# EAGLE design Clock (EAGLE 8.2.2)
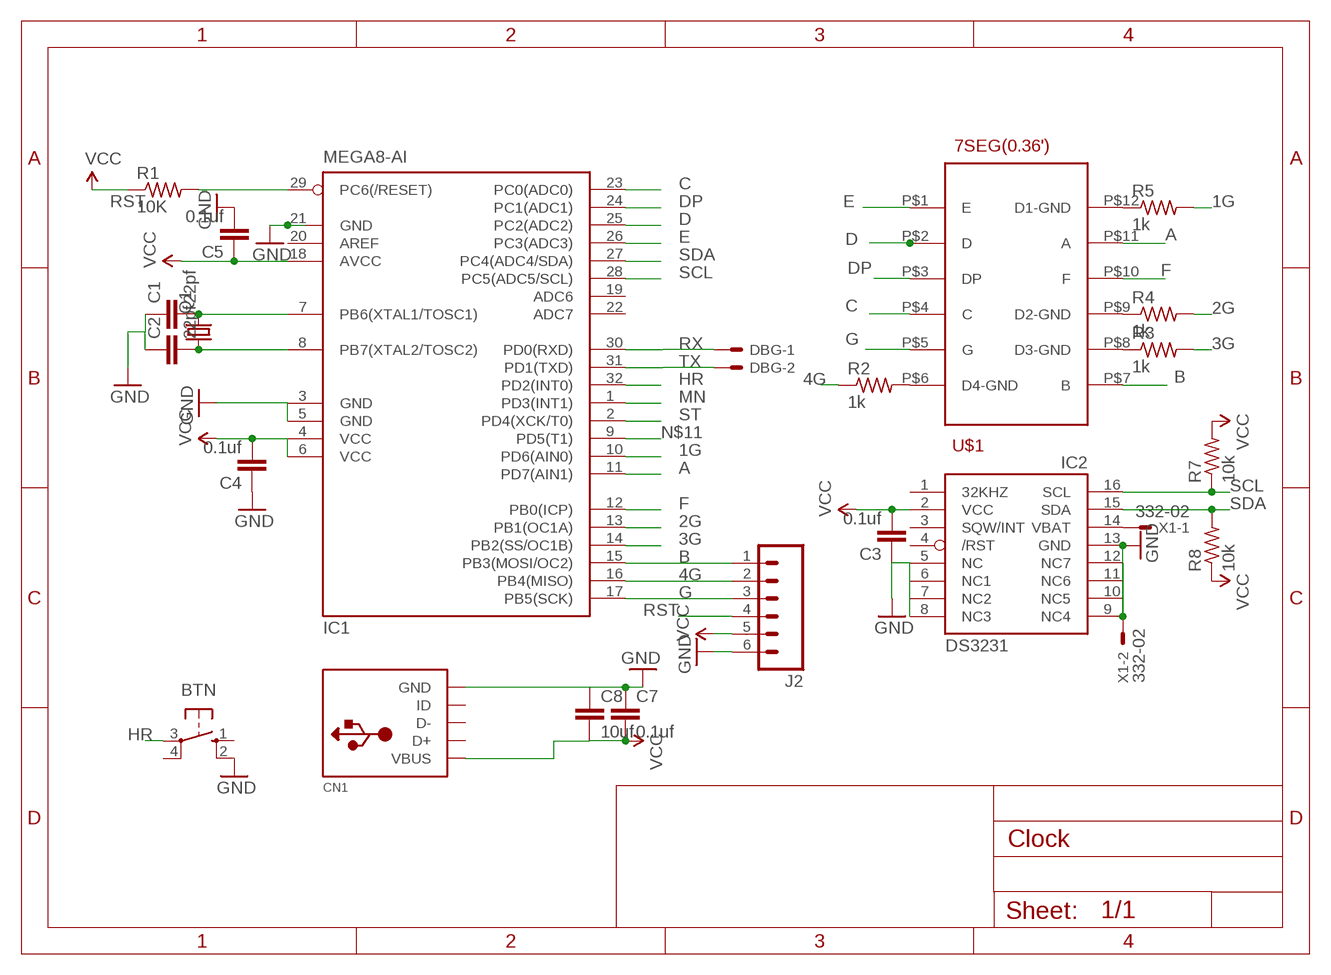
[diagram p0: schematic, sheet 1]

## Parts
BTN  10-XX  [B3F-10XX]
C1  22pf  C-EUC0603  [C0603]
C2  22pf  C-EUC0603  [C0603]
C3  0.1uf  C-EUC0603  [C0603]
C4  0.1uf  C-EUC0603  [C0603]
C5  0.1uf  C-EUC0603  [C0603]
C7  0.1uf  C-EUC0603  [C0603]
C8  10uf  C-EUC0603  [C0603]
CN1  USBMINIB  [USB-MINIB]
DBG  332-02  [332-02]
IC1  MEGA8-AI  [TQFP32-08]
IC2  DS3231/SO  [SO16W]
J2  M06LOCK_LONGPADS  [1X06_LOCK_LONGPADS]
Q1  CRYSTALHC49S  [HC49/S]
R1  10K  R-US_R0603  [R0603]
R2  1k  R-US_R0603  [R0603]
R3  1k  R-US_R0603  [R0603]
R4  1k  R-US_R0603  [R0603]
R5  1k  R-US_R0603  [R0603]
R7  10k  R-US_R0603  [R0603]
R8  10k  R-US_R0603  [R0603]
U$1  7SEG7SEG12  [DIP127SEG.36']
X1  332-02  [332-02]

## Nets
1G: IC1.10(PD6(AIN0)) R5.2
2G: IC1.13(PB1(OC1A)) R4.2
3G: IC1.14(PB2(SS/OC1B)) R3.2
4G: IC1.16(PB4(MISO)) J2.2 R2.1
A: IC1.11(PD7(AIN1)) U$1.P$11(A)
B: IC1.15(PB3(MOSI/OC2)) J2.1 U$1.P$7(B)
C: IC1.23(PC0(ADC0)) U$1.P$4(C)
D: IC1.25(PC2(ADC2)) U$1.P$2(D)
DP: IC1.24(PC1(ADC1)) U$1.P$3(DP)
E: IC1.26(PC3(ADC3)) U$1.P$1(E)
F: IC1.12(PB0(ICP)) U$1.P$10(F)
G: IC1.17(PB5(SCK)) J2.3 U$1.P$5(G)
GND: BTN.2(S1) C1.1 C2.1 C3.1 C4.1 C5.2 C7.1 C8.1 CN1.GND IC1.3(GND) IC1.5(GND) IC1.21(GND) IC2.5(NC) IC2.6(NC1) IC2.7(NC2) IC2.8(NC3) IC2.9(NC4) IC2.10(NC5) IC2.11(NC6) IC2.12(NC7) IC2.13(GND) J2.6 X1.2
HR: BTN.3(P) IC1.32(PD2(INT0))
MN: IC1.1(PD3(INT1))
N$1: IC2.14(VBAT) X1.1
N$2: R3.1 U$1.P$8(D3-GND)
N$3: R4.1 U$1.P$9(D2-GND)
N$4: R5.1 U$1.P$12(D1-GND)
N$8: C1.2 IC1.7(PB6(XTAL1/TOSC1)) Q1.2
N$11: IC1.9(PD5(T1))
N$14: R2.2 U$1.P$6(D4-GND)
N$24: C2.2 IC1.8(PB7(XTAL2/TOSC2)) Q1.1
RST: IC1.29(PC6(/RESET)) J2.4 R1.2
RX: DBG.1 IC1.30(PD0(RXD))
SCL: IC1.28(PC5(ADC5/SCL)) IC2.16(SCL) R7.1
SDA: IC1.27(PC4(ADC4/SDA)) IC2.15(SDA) R8.2
ST: IC1.2(PD4(XCK/T0))
TX: DBG.2 IC1.31(PD1(TXD))
VCC: C3.2 C4.2 C5.1 C7.2 C8.2 CN1.VBUS IC1.4(VCC) IC1.6(VCC) IC1.18(AVCC) IC2.2(VCC) J2.5 R1.1 R7.2 R8.1
Unconnected: BTN.1(S) BTN.4(P1) CN1.D+ CN1.D- CN1.ID IC1.19(ADC6) IC1.20(AREF) IC1.22(ADC7) IC2.1(32KHZ) IC2.3(SQW/INT) IC2.4(/RST)

## Library data of the parts
BTN = switch-omron:10-XX: OMRON SWITCH; MPN: B3F-1000; OC_FARNELL: 176432; OC_NEWARK: 36M3542
C1-C5 C7 C8 = rcl:C-EU: CAPACITOR, European symbol
CN1 = adafruit:USB: USB Connectors USBMINIB - Surface Mount Female Mini-B USB Connector 4UConnector: 06564 By microbuilder.eu Thru-hole RA Female Mini-B USB Connector 4UConnector: 18732 By ladyada.net
DBG X1 = con-garry:332-02: 2 Pin - 2mm Dual Row Source: www.mpe-connector.de / garry_shortform_2012.pdf
IC1 = atmel:MEGA8: MICROCONTROLLER 8 Kbytes FLASH, 1 kbytes SRAM, 512 bytes EEPROM, USART, 6-channel 10 bit ADC, 2-channel 8 bit ADC Pin compatible with Atmega48, ATMega88, ATMega168 Source: avr.lbr; MPN: ATMEGA8-16AU; OC_FARNELL: 9171371; OC_NEWARK: 73M8863
IC2 = adafruit:DS3231
J2 = SparkFun-Connectors:M06: Header 6 Standard 6-pin 0.1" header. Use with straight break away headers (SKU : PRT-00116), right angle break away headers (PRT-00553), swiss pins (PRT-00743), machine pins (PRT-00117), and female headers (PRT-00115). Molex polarized connector foot print use with SKU : PRT-08094 with associated crimp pins and housings. NOTES ON THE VARIANTS LOCK and LOCK_LONGPADS... This footprint was designed to help hold the alignment of a through-hole component (i.e. 6-pin header) while soldering it into place. You may notice that each hole has been shifted either up or down by 0.005 of an inch from it's more standard position (which is a perfectly straight line). This slight alteration caused the pins (the squares in the middle) to touch the edges of the holes. Because they are alternating, it causes a "brace" to hold the component in place. 0.005 has proven to be the perfect amount of "off-center" position when using our standard breakaway headers. Although looks a little odd when you look at the bare footprint, once you have a header in there, the alteration is very hard to notice. Also,if you push a header all the way into place, it is covered up entirely on the bottom side. This idea of altering the position of holes to aid alignment will be further integrated into the Sparkfun Library for other footprints. It can help hold any component with 3 or more connection pins.
Q1 = adafruit:CRYSTAL: CRYSTAL; OC_FARNELL: 1667008; OC_NEWARK: unknown
R1-R5 R7 R8 = adafruit:R-US_: RESISTOR, American symbol
U$1 = ram_86:7SEG

## Board
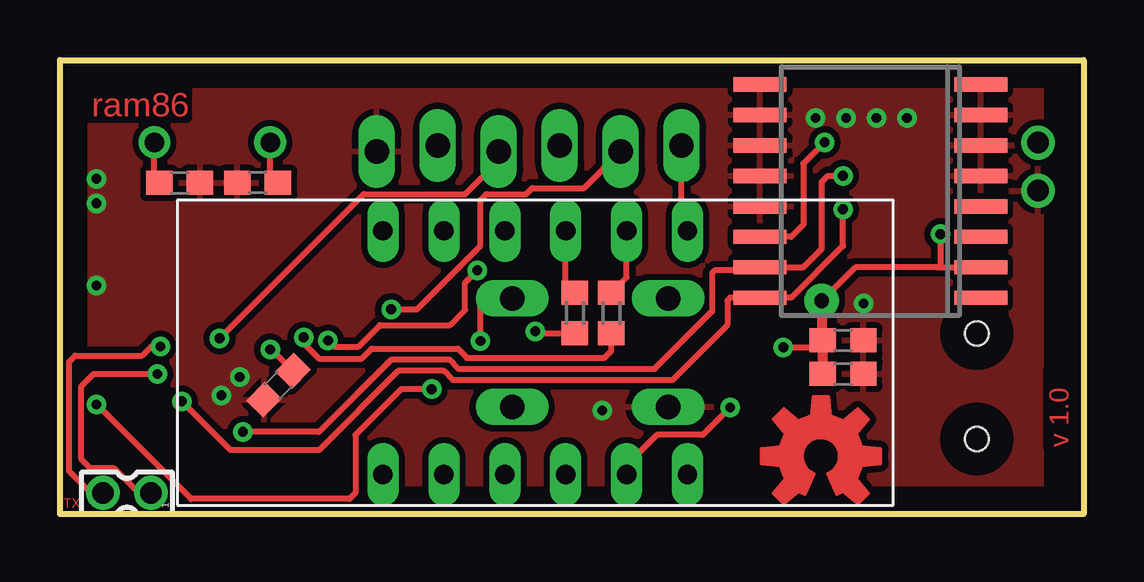
[diagram p1: board, top side]
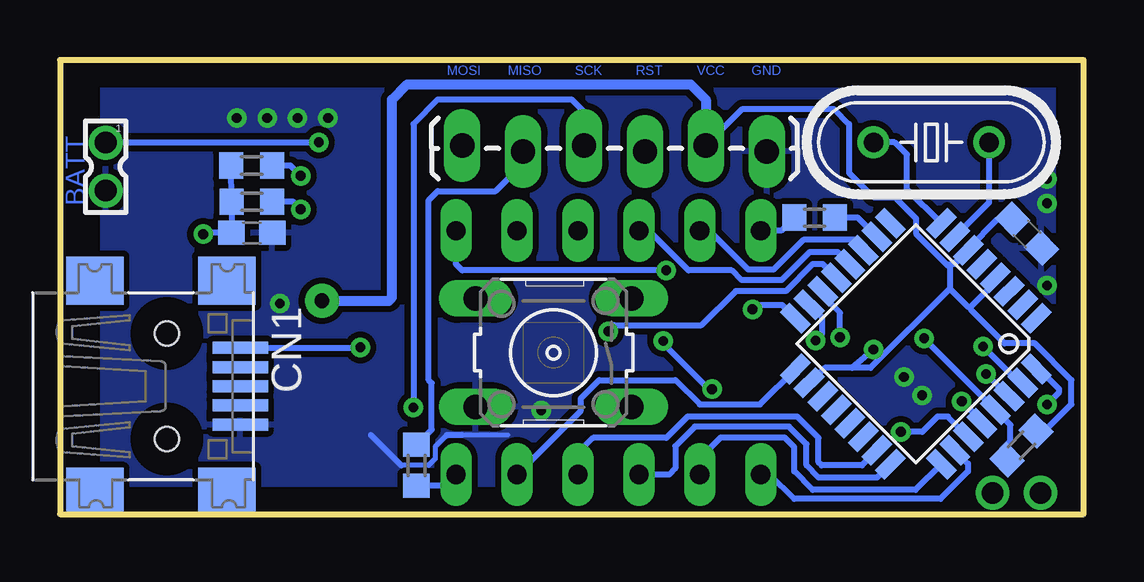
[diagram p2: board, bottom side, seen from below]

Size 42.67 x 18.92 mm. Coordinates in mm from the lower left corner, seen from the top.
Outline: 0,18.92 42.67,18.92 42.67,0 0,0 0,18.92
Copper layers (1*16): Top 0.035mm / dielectric 1.5mm / Bottom 0.035mm
Design rules "default *": minimum track width 10mil, minimum drill 24mil, track to track 10mil, track to pad 10mil, pad to pad 10mil, via to via 10mil, smd to smd 10mil, copper to edge 40mil, drill to drill 8mil, minimum pad ring 10mil, minimum via ring 8mil, stop-mask expansion 4mil, vias tented up to drill 24mil, thermal gap 10mil

### Footprints (pad centres in the part's own frame; a part is rotated, then mirrored left to right if it is on the bottom)
B3F-10XX = drill 1.016 long: 1 -3.251,2.261; 2 3.251,2.261; 3 -3.251,-2.261; 4 3.251,-2.261
C0603 = smd 1.1 x 1: 1 -0.85,0; 2 0.85,0
USB-MINIB = smd 0.5 x 2.308: D+ 0,4.064; D- -0.8,4.064; GND 1.6,4.064; ID 0.8,4.064; VBUS -1.6,4.064 | smd 2 x 2.4: GND1 -4.4,-2; GND2 -4.4,3.5; GND3 4.4,3.5; GND4 4.4,-2 | hole 1: -2.2,1; 2.2,1
332-02 = drill 0.9 pad 1.27: 1 0,-1; 2 0,1
TQFP32-08 = smd 1.27 x 0.559: 1 -4.293,2.8; 2 -4.293,2; 3 -4.293,1.2; 4 -4.293,0.4; 5 -4.293,-0.4; 6 -4.293,-1.2; 7 -4.293,-2; 8 -4.293,-2.8; 17 4.293,-2.8; 18 4.293,-2; 19 4.293,-1.2; 20 4.293,-0.4; 21 4.293,0.4; 22 4.293,1.2; 23 4.293,2; 24 4.293,2.8 | smd 0.559 x 1.27: 9 -2.8,-4.293; 10 -2,-4.293; 11 -1.2,-4.293; 12 -0.4,-4.293; 13 0.4,-4.293; 14 1.2,-4.293; 15 2,-4.293; 16 2.8,-4.293; 25 2.8,4.293; 26 2,4.293; 27 1.2,4.293; 28 0.4,4.293; 29 -0.4,4.293; 30 -1.2,4.293; 31 -2,4.293; 32 -2.8,4.293
SO16W = smd 0.6 x 2.2: 1 -4.445,-4.6; 2 -3.175,-4.6; 3 -1.905,-4.6; 4 -0.635,-4.6; 5 0.635,-4.6; 6 1.905,-4.6; 7 3.175,-4.6; 8 4.445,-4.6; 9 4.445,4.6; 10 3.175,4.6; 11 1.905,4.6; 12 0.635,4.6; 13 -0.635,4.6; 14 -1.905,4.6; 15 -3.175,4.6; 16 -4.445,4.6
1X06_LOCK_LONGPADS = drill 1.016 long: 1 0,0; 2 2.54,-0.254; 3 5.08,0; 4 7.62,-0.254; 5 10.16,0; 6 12.7,-0.254
HC49/S = drill 0.813: 1 -2.413,0; 2 2.413,0
R0603 = smd 1 x 1.1: 1 -0.85,0; 2 0.85,0
DIP127SEG.36' = drill 0.8 long: P$1 0,0; P$2 0,-2.54; P$3 0,-5.08; P$4 0,-7.62; P$5 0,-10.16; P$6 0,-12.7; P$7 10.16,-12.7; P$8 10.16,-10.16; P$9 10.16,-7.62; P$10 10.16,-5.08; P$11 10.16,-2.54; P$12 10.16,0

### Placement (x,y rotation side)
BTN  22.1,6.73 180 bottom
C1  4.99,13.81 180 top
C2  8.24,13.81 0 top
C3  34.67,11.72 180 bottom
C4  2.36,11.68 135 bottom
C5  9.11,5.37 225 top
C7  32.64,5.84 180 top
C8  32.64,7.24 180 top
CN1  39.22,5.33 270 bottom
DBG  2.79,0.89 90 top
IC1  6.99,7.1 225 bottom
IC2  33.78,13.46 90 top
J2  25.91,15.37 0 bottom
LOGO2  OSHW-LOGOM-COPPER  [OSHW-LOGO-M_COPPER]  31.72,2.41 0 top
Q1  6.35,15.49 0 bottom
R1  2.59,2.87 225 bottom
R2  27.81,2.03 270 bottom
R3  22.99,8.38 270 top
R4  21.46,8.38 270 top
R5  11.21,12.36 0 bottom
R7  34.67,13.02 180 bottom
R8  34.69,14.53 0 bottom
U$1  13.46,1.65 90 top
X1  40.77,14.48 180 bottom

### Tracks (layer width: path | path; a pad name or v marks a point on that pad's centre or on a via)
1G
  Bottom 0.254: IC1.10 9.42,12.36 R5.2
2G  (via drill 0.41)
  Top 0.254: v19.81,7.62 19.9,7.53 R4.2
  Bottom 0.254: IC1.13 10.87,10.41 11.3,10.41 12.42,9.3 14.5,9.3 15.93,7.87 19.56,7.87 v19.81,7.62
3G  (via drill 0.41)
  Top 0.254: 22.73,7.41 R3.2 22.99,6.81 22.69,6.52 16.97,6.52 16.59,6.9 12.99,6.9 12.57,6.48 10.79,6.48 10.16,7.11 v10.16,7.37
  Bottom 0.254: IC1.14 10.9,9.27 11.05,9.27 10.16,8.38 v10.16,7.37
4G  (via drill 0.41)
  Top 0.254: J2.2 21.84,13.59 19.68,13.59 19.43,13.34 17.78,13.34 17.53,13.08 17.53,11.18 16.55,10.2 | 16.55,10.2 16.51,10.16 | v13.8,8.53 14.88,8.53 16.55,10.2
  Bottom 0.254: R2.1 27.18,3.52 27.18,5.46 27.3,5.59 27.3,13.08 26.92,13.46 24.51,13.46 23.37,14.61 J2.2 | v13.8,8.53 13.61,8.73 12.58,8.73 IC1.16
A
  Bottom 0.254: IC1.11 9.18,11.09 9.52,11.43 11.68,11.43 12.93,10.19 13.98,10.19 15.61,11.81 U$1.P$11 15.62,11.81
B  (via drill 0.41)
  Top 0.254: v17.4,10.16 16.89,9.65 16.89,8.51 16.26,7.87 13.33,7.87 12.45,6.99 11.43,6.99 v11.18,7.24 | U$1.P$7 25.91,12.07 J2.1
  Bottom 0.254: IC1.15 10.92,8.2 10.92,7.49 v11.18,7.24 | v17.4,10.16 25.91,10.16 26.16,10.41 U$1.P$7
C
  Bottom 0.254: IC1.23 9.24,2.03 10.92,2.03 11.05,2.16 11.05,3.18 11.94,4.06 16.51,4.06 17.4,3.18 20.45,3.18 21.08,2.54 U$1.P$4
D
  Bottom 0.254: IC1.25 7.01,1.02 11.3,1.02 12.06,1.78 12.06,2.79 12.46,3.19 15.14,3.19 16,2.32 U$1.P$2 16.01,1.66 16.01,1.7 16,1.71 15.99,1.71 16,1.7 16,1.56
DP
  Bottom 0.254: IC1.24 8.61,1.52 11.05,1.52 11.56,2.03 11.56,2.92 12.28,3.65 16.21,3.65 17.02,2.83 17.02,1.91 17.27,1.65 U$1.P$3
E
  Bottom 0.254: IC1.26 4.83,2.11 4.83,1.78 5.97,0.64 12.06,0.64 13.08,1.65 U$1.P$1
F
  Bottom 0.254: IC1.12 10.25,10.92 11.43,10.92 12.6,9.75 14.26,9.75 14.67,10.16 16.47,10.16 18.12,11.81 U$1.P$10
G  (via drill 0.41)
  Top 0.254: v27.94,4.45 26.8,3.3 24.89,3.3 23.62,2.03 U$1.P$5
  Bottom 0.254: U$1.P$5 20.95,4.32 20.95,4.83 20.19,5.59 17.02,5.59 16,4.57 13.48,4.57 IC1.17 | J2.3 20.83,16.76 21.34,17.27 26.92,17.27 27.94,16.26 v27.94,4.45
GND  (via drill 0.41)
  Bottom 0.203: 26.54,3.3 27.03,2.81 27.03,2.3 27.3,2.03 28.45,2.03 | BTN.2 25.37,4.45 25.4,4.45 | 25.91,3.3 24,3.3
  Bottom 0.254: 29.72,3.3 28.45,2.03 | 26.54,3.3 25.91,3.3
  other vias: 22.61,4.32 6.73,4.95 7.49,5.71 1.52,13.97 1.52,12.95 1.52,9.52 31.5,16.51 32.77,16.51 34.04,16.51 35.31,16.51 33.5,8.78
  pour Bottom: 0.13,18.92 40.89,18.92 40.89,-0.25 0.13,-0.25
  pour Top: 0,18.92 40.89,18.92 40.89,-0.25 0,-0.25
HR  (via drill 0.41)
  Top 0.254: BTN.3 18.82,9.02 17.78,9.02 17.53,8.76 v17.53,7.21 17.53,7.18 | v15.49,5.21 14.22,5.21 12.32,3.3 12.32,0.89 12.06,0.64 5.46,0.64 v1.52,4.57
  Bottom 0.254: v15.49,5.21 15.62,5.21 17.5,7.09 v17.53,7.21 | v1.52,4.57 1.02,5.08 1.02,5.21 1.86,6.05 IC1.32
N$1  (via drill 0.41)
  Top 0.254: v31.88,15.49 30.99,14.61 30.99,12.07 30.48,11.56 IC2.14
  Bottom 0.254: X1.1 41,15.49 v31.88,15.49
N$2
  Top 0.254: R3.1 23.62,9.87 U$1.P$8
N$3
  Top 0.254: R4.1 21.08,9.61 U$1.P$9
N$4
  Bottom 0.254: R5.1 12.61,11.81 U$1.P$12
N$8
  Top 0.254: C1.2 3.94,14.01 Q1.2
  Bottom 0.254: IC1.7 3.94,12.99 Q1.2
N$14
  Bottom 0.254: U$1.P$6 26.63,1.18 R2.2
N$24
  Top 0.254: C2.2 8.76,14.13 Q1.1
  Bottom 0.254: IC1.8 7.37,13.55 7.37,14.99 7.87,15.49 Q1.1
RST  (via drill 0.41)
  Top 0.254: v6.65,7.33 12.66,13.34 16.89,13.34 18.29,14.73 J2.4
  Bottom 0.254: 3.68,4.18 IC1.29 | IC1.29 v6.65,7.33 | IC1.29 3.05,3.72 3.05,3.05 3.43,2.67 3.43,2.5 R1.2
RX  (via drill 0.41)
  Top 0.254: DBG.1 3.29,0.89 2.27,1.91 1.27,1.91 0.89,2.29 0.89,5.33 1.4,5.84 v4.06,5.84
  Bottom 0.254: v4.06,5.84 3.14,4.92 IC1.30
SCL  (via drill 0.41)
  Top 0.254: v5.08,4.7 7.11,2.67 10.79,2.67 14.1,5.97 16,5.97 16.38,5.59 25.53,5.59 27.81,7.87 27.81,8.89 27.94,9.02 IC2.16 30.48,9.02 32.64,11.18 v32.64,12.7
  Bottom 0.254: v5.08,4.7 4.24,3.86 IC1.28 | v32.64,12.7 32.96,13.02 R7.1
SDA  (via drill 0.41)
  Top 0.254: v7.62,3.43 10.79,3.43 13.82,6.45 16.23,6.45 16.62,6.06 24.79,6.06 27.18,8.45 27.18,10.03 27.3,10.16 29.05,10.16 IC2.15 30.99,10.29 31.75,11.05 31.75,13.84 32,14.1 v32.64,14.1
  Bottom 0.254: 7.24,3.43 v7.62,3.43 6.73,3.43 6.1,4.06 5.65,4.06 IC1.27 | v32.64,14.1 33.07,14.53 R8.2
TX  (via drill 0.41)
  Top 0.254: DBG.2 1.29,0.89 0.38,1.79 0.38,6.35 0.63,6.6 3.43,6.6 3.81,6.99 v4.19,6.99
  Bottom 0.254: v4.19,6.99 2.69,5.48 IC1.31
VCC  (via drill 0.41, 0.61 pad 1.42)
  Top 0.254: C5.1 9.02,6.66 v8.76,6.86 | v31.75,8.89 33.15,10.29 36.57,10.29 | v30.15,6.95 31.69,6.95 31.79,7.05 C8.2 | 36.57,10.29 IC2.2 | v36.7,11.67 36.7,10.29 36.57,10.29
  Top 0.406: 31.79,7.05 C7.2 31.53,5.59 | C8.2 31.75,7.28 v31.75,8.89
  Bottom 0.254: J2.5 14.22,16.89 10.41,16.89 9.78,16.26 9.78,14.22 8.76,13.21 7.87,13.21 6.98,12.32 6.98,11.68 5.71,10.41 | 5.71,10.41 5.46,10.41 | 5.46,10.41 4.89,10.99 IC1.6 | 4.7,8.64 4.7,8.51 3.3,7.11 2.03,7.11 0.51,5.59 0.51,4.57 1.61,3.47 R1.1 | 4.7,8.64 3.68,9.66 IC1.4 | IC1.6 4.81,11.07 3.59,12.29 C4.2 | IC1.6 5.38,10.41 5.46,10.41 | 5.71,10.41 5.59,10.29 5.59,9.4 | 5.59,9.4 4.83,8.64 4.7,8.64 | 5.59,9.4 8.89,6.1 9.65,6.1 | IC1.18 11.41,5.48 10.79,6.1 9.65,6.1 | v8.76,6.86 9.65,6.1 | R8.1 R7.2 C3.2 36.58,11.72 | CN1.VBUS 30.18,6.93 30.17,6.92 30.17,6.93 v30.15,6.95 | 36.58,11.72 36.58,11.71 | 36.58,11.72 36.62,11.72 v36.7,11.67
  Bottom 0.406: v31.75,8.89 28.96,8.89 28.83,9.02 28.83,17.27 28.19,17.91 16.38,17.91 15.75,17.27 J2.5

### Text on the board
Top: ram86 | v 1.0 | TX
Bottom: GND | VCC | RST | SCK | MISO | MOSI | BATT
tStop: ram86 | v 1.0 | TX\
bStop: GND | VCC | RST | SCK | MISO | MOSI | BATT